# EAGLE design meca_2014_VaccumSystemExtension (EAGLE 6.5.0)
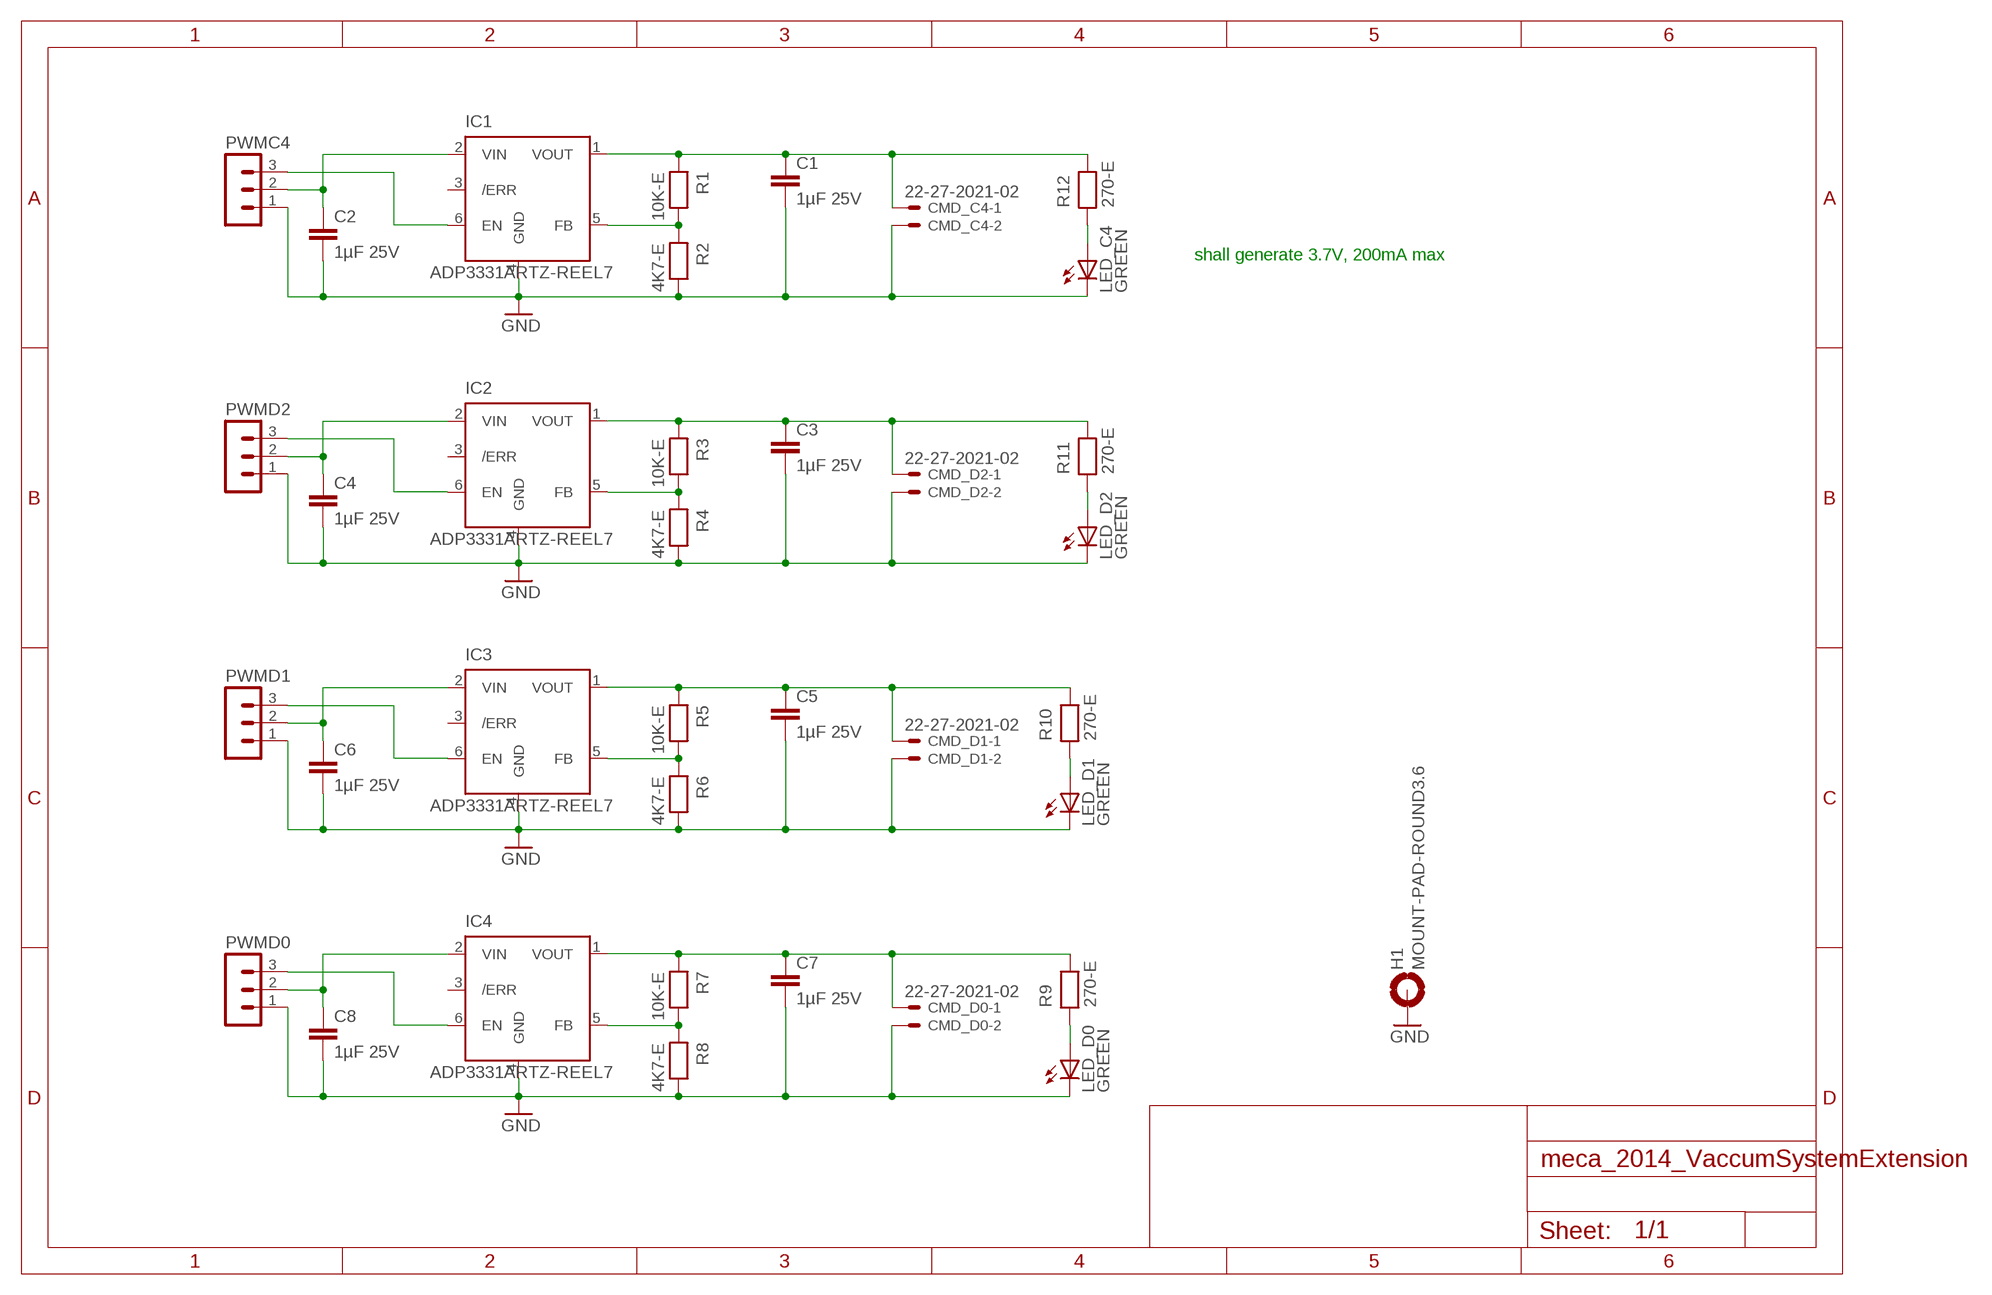
[diagram p0: schematic, sheet 1]

## Parts
C1  1µF 25V  1UFD_25V  [C1206]
C2  1µF 25V  1UFD_25V  [C1206]
C3  1µF 25V  1UFD_25V  [C1206]
C4  1µF 25V  1UFD_25V  [C1206]
C5  1µF 25V  1UFD_25V  [C1206]
C6  1µF 25V  1UFD_25V  [C1206]
C7  1µF 25V  1UFD_25V  [C1206]
C8  1µF 25V  1UFD_25V  [C1206]
CMD_C4  22-27-2021-02  [6410-02]
CMD_D0  22-27-2021-02  [6410-02]
CMD_D1  22-27-2021-02  [6410-02]
CMD_D2  22-27-2021-02  [6410-02]
H1  MOUNT-PAD-ROUND3.6  [3,6-PAD]
IC1  ADP3331ARTZ-REEL7  [SOT23-6]
IC2  ADP3331ARTZ-REEL7  [SOT23-6]
IC3  ADP3331ARTZ-REEL7  [SOT23-6]
IC4  ADP3331ARTZ-REEL7  [SOT23-6]
LED_C4  GREEN  LED_G  [CHIP-LED0805]
LED_D0  GREEN  LED_G  [CHIP-LED0805]
LED_D1  GREEN  LED_G  [CHIP-LED0805]
LED_D2  GREEN  LED_G  [CHIP-LED0805]
PWMC4  MA03-1  [MA03-1]
PWMD0  MA03-1  [MA03-1]
PWMD1  MA03-1  [MA03-1]
PWMD2  MA03-1  [MA03-1]
R1  10K-E  [R0805]
R2  4K7-E  [R0805]
R3  10K-E  [R0805]
R4  4K7-E  [R0805]
R5  10K-E  [R0805]
R6  4K7-E  [R0805]
R7  10K-E  [R0805]
R8  4K7-E  [R0805]
R9  270-E  [R0805]
R10  270-E  [R0805]
R11  270-E  [R0805]
R12  270-E  [R0805]

## Nets
5V_C4: C2.1 IC1.2(VIN) PWMC4.2
5V_D0: C8.1 IC4.2(VIN) PWMD0.2
5V_D1: C6.1 IC3.2(VIN) PWMD1.2
5V_D2: C4.1 IC2.2(VIN) PWMD2.2
GND: C1.2 C2.2 C3.2 C4.2 C5.2 C6.2 C7.2 C8.2 CMD_C4.2 CMD_D0.2 CMD_D1.2 CMD_D2.2 H1.B3,6(MOUNT) IC1.4(GND) IC2.4(GND) IC3.4(GND) IC4.4(GND) LED_C4.C LED_D0.C LED_D1.C LED_D2.C PWMC4.1 PWMD0.1 PWMD1.1 PWMD2.1 R2.2 R4.2 R6.2 R8.2
N$1: IC1.5(FB) R1.2 R2.1
N$2: IC2.5(FB) R3.2 R4.1
N$3: C1.1 CMD_C4.1 IC1.1(VOUT) R1.1 R12.2
N$4: LED_D0.A R9.1
N$5: LED_D1.A R10.1
N$6: C3.1 CMD_D2.1 IC2.1(VOUT) R3.1 R11.2
N$7: LED_C4.A R12.1
N$8: LED_D2.A R11.1
N$9: IC3.5(FB) R5.2 R6.1
N$10: C5.1 CMD_D1.1 IC3.1(VOUT) R5.1 R10.2
N$13: IC4.5(FB) R7.2 R8.1
N$14: C7.1 CMD_D0.1 IC4.1(VOUT) R7.1 R9.2
PWM_C4_5V: IC1.6(EN) PWMC4.3
PWM_D0_5V: IC4.6(EN) PWMD0.3
PWM_D1_5V: IC3.6(EN) PWMD1.3
PWM_D2_5V: IC2.6(EN) PWMD2.3
Unconnected: IC1.3(/ERR) IC2.3(/ERR) IC3.3(/ERR) IC4.3(/ERR)

## Notes on the sheet
- shall generate 3.7V, 200mA max

## Library data of the parts
C1-C8 = robotter_capacitor:1UF; MOUSER: 810-C3216X7R1E105K-6; RS: 740-7574
CMD_C4 CMD_D0 CMD_D1 CMD_D2 = robotter_connector:22-?-02: CONNECTOR wire to board 2.54 mm (.1 inch) pitch header; MOUSER: 538-22-27-2021; RS: 483-8461
H1 = holes:MOUNT-PAD-ROUND: MOUNTING PAD, round
IC1-IC4 = robotter_ic:ADP3331ARTZ-REEL7
LED_C4 LED_D0 LED_D1 LED_D2 = robotter_diode:LED_; MOUSER: 859-LTST-C171GKT; RS: 692-0935
PWMC4 PWMD0 PWMD1 PWMD2 = con-lstb:MA03-1: PIN HEADER; OC_FARNELL: unknown; OC_NEWARK: unknown
R1 R3 R5 R7 = robotter_resistor:10K; MOUSER: 71-CRCW080510K0FKEB; RS: 740-9072
R2 R4 R6 R8 = robotter_resistor:4K7; MOUSER: 71-CRCW0805-4.7K-E3; RS: 223-0528
R9-R12 = robotter_resistor:270; MOUSER: 660-RK73H2ATTD2700F; RS: 740-9019

## Board
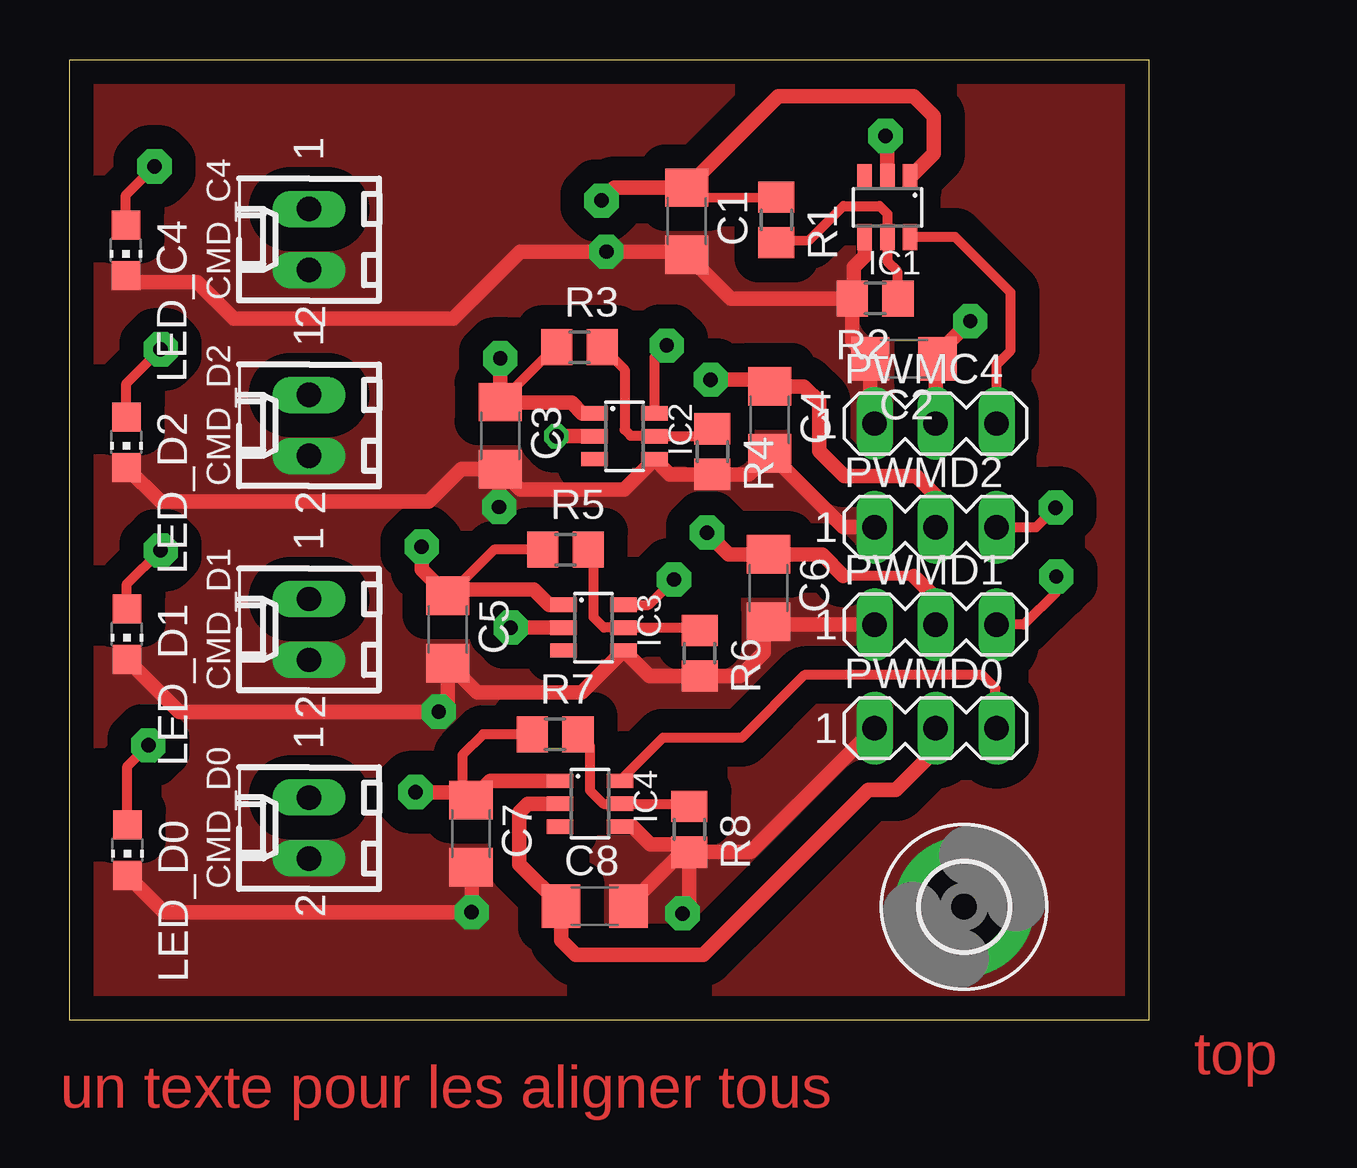
[diagram p1: board, top side]
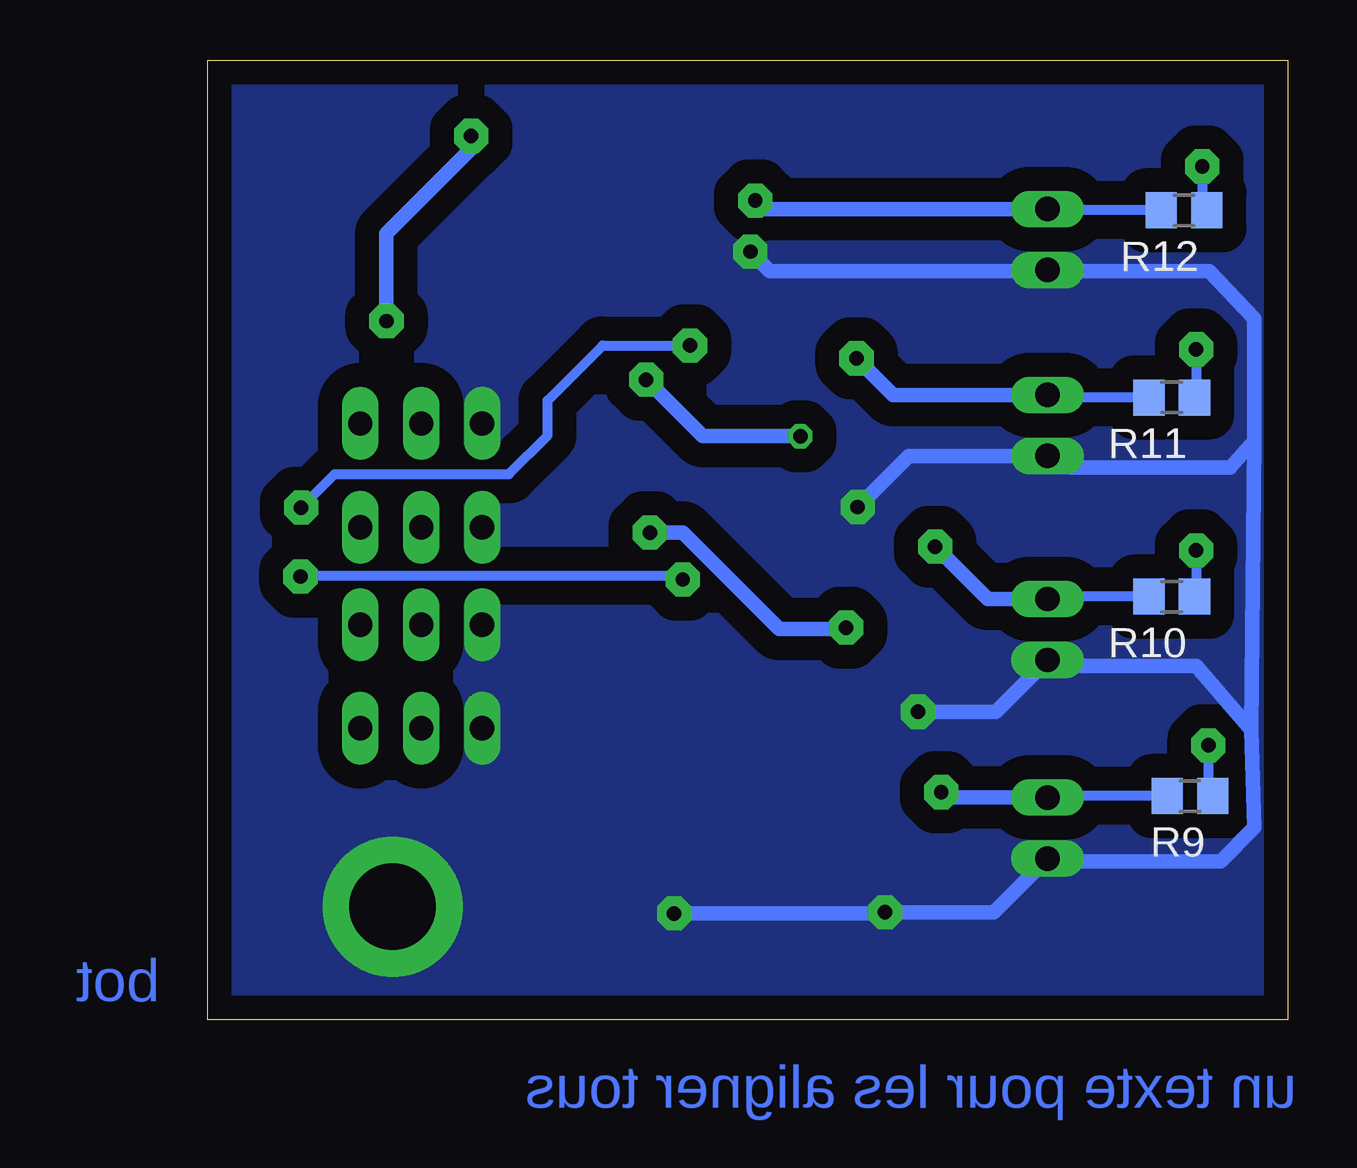
[diagram p2: board, bottom side, seen from below]

Size 45 x 40 mm. Coordinates in mm from the lower left corner, seen from the top.
Outline: 0,0 45,0 45,40 0,40 0,0
Copper layers (1*16): Top 0.035mm / dielectric 1.5mm / Bottom 0.035mm
Design rules "default *": minimum track width 0.4mm, minimum drill 0.6mm, track to track 1mm, track to pad 0.8mm, pad to pad 0.8mm, via to via 0.8mm, smd to smd 8mil, copper to edge 1mm, drill to drill 8mil, minimum pad ring 10mil, minimum via ring 8mil, stop-mask expansion 4mil, vias tented up to drill 0mil, thermal gap 10mil

### Footprints (pad centres in the part's own frame; a part is rotated, then mirrored left to right if it is on the bottom)
C1206 = smd 1.6 x 1.8: 1 -1.4,0; 2 1.4,0
6410-02 = drill 1.016 long: 1 1.27,0; 2 -1.27,0
3,6-PAD = drill 3.6 pad 5.842: B3,6 0,0
SOT23-6 = smd 0.6 x 1.1: 1 -0.95,-1.25; 2 0,-1.25; 3 0.95,-1.25; 4 0.95,1.25; 5 0,1.25; 6 -0.95,1.25
CHIP-LED0805 = smd 1.2 x 1.2: A 0,-1.05; C 0,1.05
MA03-1 = drill 1.016 long: 1 -2.54,0; 2 0,0; 3 2.54,0
R0805 = smd 1.3 x 1.5: 1 -0.95,0; 2 0.95,0

### Placement (x,y rotation side)
C1  25.74,33.28 270 top
C2  34.78,27.54 180 top
C3  17.96,24.34 270 top
C4  29.19,25 270 top
C5  15.78,16.26 270 top
C6  29.14,17.99 270 top
C7  16.75,7.75 270 top
C8  21.9,4.73 0 top
CMD_C4  10,32.52 90 top
CMD_D0  10,7.98 90 top
CMD_D1  10,16.26 90 top
CMD_D2  10,24.77 90 top
H1  37.29,4.7 0 top
IC1  34.09,33.86 180 top
IC2  23.15,24.31 270 top
IC3  21.85,16.34 270 top
IC4  21.7,9 270 top
LED_C4  2.37,32.06 180 top
LED_D0  2.43,7.06 180 top
LED_D1  2.41,16.06 180 top
LED_D2  2.39,24.06 180 top
PWMC4  36.1,24.85 0 top
PWMD0  36.1,12.15 0 top
PWMD1  36.1,16.46 0 top
PWMD2  36.1,20.53 0 top
R1  29.47,33.33 270 top
R2  33.59,30.05 180 top
R3  21.27,28.02 0 top
R4  26.8,23.68 270 top
R5  20.68,19.59 0 top
R6  26.27,15.27 270 top
R7  20.25,11.89 0 top
R8  25.84,7.93 270 top
R9  4.06,9.32 180 bottom
R10  4.83,17.63 180 bottom
R11  4.83,25.93 180 bottom
R12  4.32,33.73 180 bottom

### Tracks (layer width: path | path; a pad name or v marks a point on that pad's centre or on a via)
5V_C4  (via drill 0.6 pad 1.42)
  Top 0.61: PWMC4.2 36.1,27.46 C2.1 36.18,27.75 v37.55,29.11 | v34.02,36.84 34.09,36.51 IC1.2
  Bottom 0.61: v37.55,29.11 37.55,32.77 34.02,36.3 v34.02,36.84
5V_D0
  Top 0.61: IC4.2 19.11,9 18.75,8.64 18.75,6.48 C8.1 20.5,3.31 21.11,2.7 26.42,2.7 33.31,9.58 34.45,9.58 36.1,11.23 PWMD0.2
5V_D1  (via drill 0.6 pad 1.42)
  Top 0.406: 35.19,18.5 32.27,18.5
  Top 0.61: PWMD1.2 36.1,17.58 35.19,18.5 | 32.27,18.5 31.37,19.39 C6.1 27.49,19.39 v26.57,20.3 | v18.4,16.34 IC3.2
  Bottom 0.61: v26.57,20.3 25.2,20.3 21.19,16.29 18.45,16.29 v18.4,16.34
5V_D2  (via drill 0.6, 0.6 pad 1.42)
  Top 0.61: PWMD2.2 36.1,21.85 35.29,22.66 32.29,22.66 31.25,23.7 31.25,25.76 30.61,26.39 C4.1 28.91,26.68 v26.73,26.68 | v20.3,24.31 IC2.2
  Bottom 0.61: v26.73,26.68 24.36,24.31 v20.3,24.31
GND  (via drill 0.6 pad 1.42)
  Top 0.61: PWMC4.1 33.38,25.03 C2.2 32.63,28.28 R2.2 | IC1.4 33.14,31.82 32.7,31.37 32.7,30.11 R2.2 | R2.2 27.56,30.05 C1.2 25.61,32.01 v22.38,32.01 18.8,32.01 16,29.21 6.86,29.21 5.33,30.73 2.65,30.73 LED_C4.C | PWMD2.1 32.26,20.53 C4.2 28.32,22.73 R4.2 25.03,22.73 IC2.4 23.14,22.1 18.8,22.1 C3.2 | C3.2 17.91,22.89 v17.91,21.37 | PWMD1.1 29.26,16.46 C6.2 28.94,16.39 28.94,15.3 27.96,14.32 R6.2 24.17,14.32 IC3.4 21.36,13.64 17,13.64 C5.2 15.78,13.21 v15.4,12.83 4.59,12.83 LED_D1.C | PWMD0.1 28.39,6.98 R8.2 | C8.2 25.55,6.98 | 25.55,6.98 R8.2 | 25.55,6.98 25.24,7.29 24.21,7.29 23.46,8.05 IC4.4 | C7.2 16.77,6.33 v16.77,4.47 3.97,4.47 LED_D0.C | v25.56,4.42 25.84,4.7 R8.2 | LED_D2.C 3.81,21.59 14.99,21.59 16.33,22.94 C3.2
  Bottom 0.61: v22.38,32.01 21.57,31.2 9.95,31.2 | v25.56,4.42 16.82,4.42 v16.77,4.47 12.23,4.47 CMD_D0.2 | v15.4,12.83 12.16,12.83 CMD_D1.2 9.74,14.73 3.81,14.73 1.52,12.06 | CMD_D0.2 9.9,6.81 | 9.95,31.2 CMD_C4.2 | v17.91,21.37 15.78,23.5 CMD_D2.2 9.51,23.01 LED_D2.C 1.4,24.13 | 9.95,31.2 3.26,31.2 1.4,29.21 1.4,24.13 | 1.4,24.13 1.52,12.06 | CMD_D0.2 9.89,6.6 2.79,6.6 1.4,8 1.52,12.06
  pour Bottom (no thermals): -1,-2 -1,42 47,42 47,-2
  pour Top (no thermals): -1,-2 -1,43 48,43 48,-2
N$1
  Top 0.406: R1.2 29.58,32.47 30.84,32.49 32.11,33.76 32.26,33.91 33.77,33.91 34.09,33.58 IC1.5 34.09,31.6 34.5,31.2 34.5,30.09 R2.1
N$2
  Top 0.406: R3.2 23.15,27.09 23.15,24.59 23.4,24.34 24.37,24.34 IC2.5 26.49,24.31 R4.1
N$3  (via drill 0.6 pad 1.42)
  Top 0.406: R1.1 26.16,34.25 C1.1
  Top 0.61: IC1.1 36.02,36.09 36.02,37.65 35.19,38.49 29.54,38.49 C1.1 22.72,34.68 v22.18,34.14
  Bottom 0.406: R12.2 9.94,33.73 CMD_C4.1
  Bottom 0.61: v22.18,34.14 21.82,33.79 CMD_C4.1
N$4  (via drill 0.6 pad 1.42)
  Top 0.406: LED_D0.A 2.43,10.56 v3.3,11.43
  Bottom 0.406: v3.3,11.43 3.3,9.51 R9.1
N$5  (via drill 0.6 pad 1.42)
  Top 0.406: LED_D1.A 2.41,18.16 v3.81,19.56
  Bottom 0.406: v3.81,19.56 3.81,17.69 R10.1
N$6  (via drill 0.6 pad 1.42)
  Top 0.406: R3.1 20.25,28.02 C3.1
  Top 0.61: v17.96,27.56 C3.1 18.44,25.26 17.96,25.79 18.04,25.71 20.94,25.71 21.38,25.26 IC2.1
  Bottom 0.406: R11.2 10.56,25.93 10.67,26.04
  Bottom 0.61: v17.96,27.56 16.44,26.04 10.67,26.04 CMD_D2.1
N$7  (via drill 0.6 pad 1.42)
  Top 0.406: LED_C4.A 2.37,34.37 v3.56,35.56
  Bottom 0.406: v3.56,35.56 3.56,33.92 R12.1
N$8  (via drill 0.6 pad 1.42)
  Top 0.406: LED_D2.A 2.39,26.52 v3.81,27.94
  Bottom 0.406: v3.81,27.94 3.81,26 R11.1
N$9
  Top 0.406: R6.1 26.15,16.34 IC3.5 22.28,16.34 21.85,16.77 21.85,19.37 R5.2
N$10  (via drill 0.6 pad 1.42)
  Top 0.406: R5.1 17.71,19.59 C5.1
  Top 0.61: IC3.1 20.01,17.29 19.36,17.94 16.06,17.94 C5.1 14.69,18.75 v14.69,19.71
  Bottom 0.406: R10.2 9.9,17.63 CMD_D1.1
  Bottom 0.61: v14.69,19.71 12.5,17.53 CMD_D1.1
N$13
  Top 0.406: R8.1 25.72,9 IC4.5 22.26,9 21.7,9.55 21.7,11.39 R7.2
N$14  (via drill 0.6 pad 1.42)
  Top 0.406: R7.1 17.25,11.89 16.39,11.03 16.39,9.51 C7.1
  Top 0.61: C7.1 17.54,9.95 IC4.1 | 16.39,9.51 16.36,9.48 v14.43,9.48
  Bottom 0.406: R9.2 10.6,9.32 10.67,9.25
  Bottom 0.61: v14.43,9.48 14.21,9.25 10.67,9.25 CMD_D0.1
PWM_C4_5V
  Top 0.406: PWMC4.3 38.64,27.31 39.22,27.89 39.22,30.31 36.91,32.62 IC1.6
PWM_D0_5V
  Top 0.406: PWMD0.3 38.59,12.2 38.59,13.82 38.06,14.36 30.64,14.36 28.02,11.74 24.74,11.74 IC4.6
PWM_D1_5V  (via drill 0.6 pad 1.42)
  Top 0.406: IC3.6 24.15,17.29 v25.2,18.34 | v41.13,18.47 41.13,17.81 39.78,16.46 PWMD1.3
  Bottom 0.406: v25.2,18.34 25.32,18.36 25.45,18.49 40.85,18.49 41,18.34 v41.13,18.47
PWM_D2_5V  (via drill 0.6 pad 1.42)
  Top 0.406: PWMD2.3 40.29,20.53 v41.1,21.34 | IC2.6 24.4,27.59 v24.9,28.1
  Bottom 0.406: v41.1,21.34 39.71,22.74 32.44,22.74 30.84,24.34 30.84,25.81 28.55,28.1 v24.9,28.1

### Text on the board
Top: top | un texte pour les aligner tous
Bottom: bot | un texte pour les aligner tous